# EAGLE design Mini Power Supply (EAGLE 6.4)
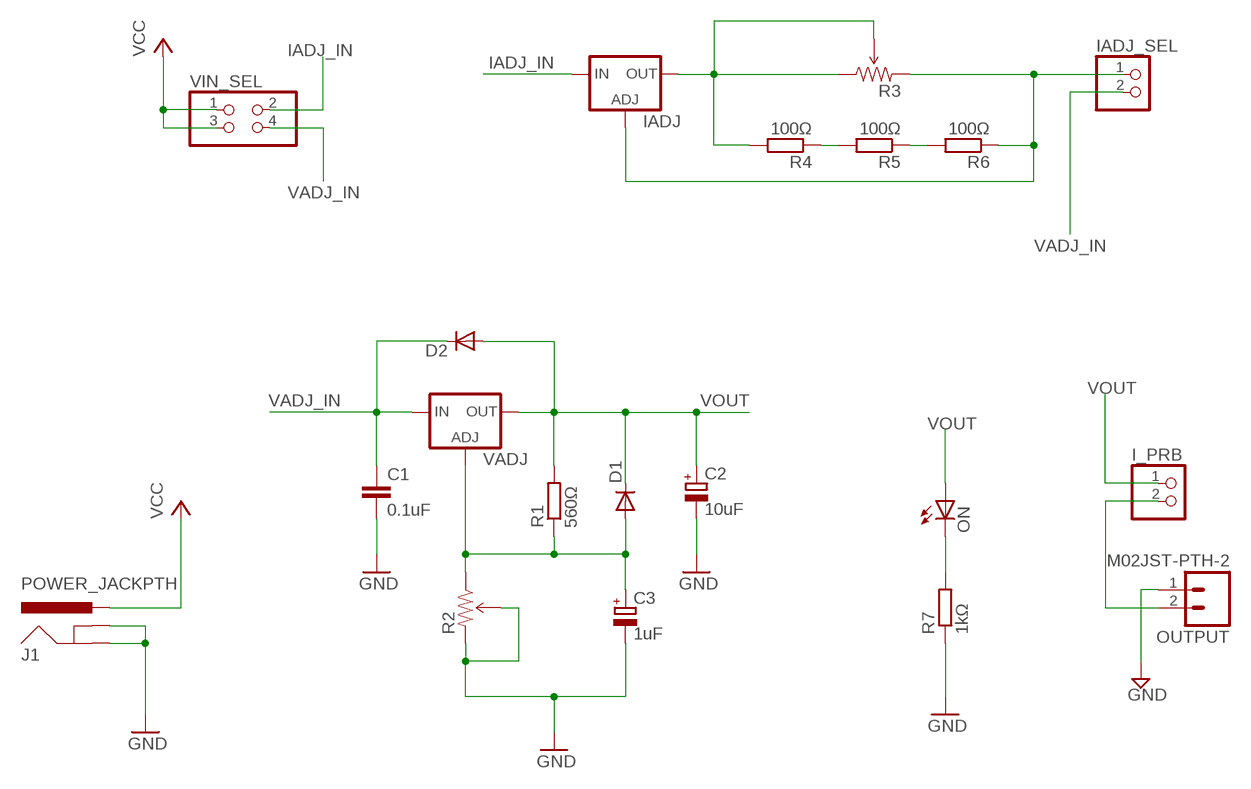
[diagram p0: schematic, sheet 1]

## Parts
C1  0.1uF  C-EUC0805  [C0805]
C2  10uF  CPOL-EUE2.5-6  [E2,5-6]
C3  1uF  CPOL-EUE2.5-6  [E2,5-6]
D1  DIODE-SOD323-W  [SOD323-W]
D2  DIODE-SOD323-W  [SOD323-W]
I_PRB  PINHD-1X2  [1X02]
IADJ  LM317TS  [317TS]
IADJ_SEL  PINHD-1X2  [1X02]
J1  POWER_JACKPTH  [POWER_JACK_PTH]
ON  LEDCHIPLED_1206  [CHIPLED_1206]
OUTPUT  M02JST-PTH-2  [JST-2-PTH]
R1  560Ω  R-EU_R0805  [R0805]
R2  TRIMPOT-PTH-KNOB  [3386U]
R3  TRIMPOT-PTH-KNOB  [3386U]
R4  100Ω  R-EU_R0805  [R0805]
R5  100Ω  R-EU_R0805  [R0805]
R6  100Ω  R-EU_R0805  [R0805]
R7  1kΩ  R-EU_R0805  [R0805]
VADJ  LM317TS  [317TS]
VIN_SEL  PINHD-2X2  [2X02]

## Nets
GND: C1.2 C2.- C3.- J1.GND J1.GNDBREAK OUTPUT.1 R2.2(WIPER) R2.3(CW) R7.1
IADJ_IN: IADJ.3(IN) VIN_SEL.2
N$1: IADJ.2(OUT) R3.1(CCW) R3.2(WIPER) R4.2
N$2: R4.1 R5.2
N$3: C3.+ D1.A R1.1 R2.1(CCW) VADJ.1(ADJ)
N$4: IADJ.1(ADJ) IADJ_SEL.1 R3.3(CW) R6.1
N$5: R5.1 R6.2
N$6: ON.C R7.2
N$7: I_PRB.2 OUTPUT.2
VADJ_IN: C1.1 D2.C IADJ_SEL.2 VADJ.3(IN) VIN_SEL.4
VCC: J1.PWR VIN_SEL.1 VIN_SEL.3
VOUT: C2.+ D1.C D2.A I_PRB.1 ON.A R1.2 VADJ.2(OUT)

## Library data of the parts
C1 = rcl:C-EU: CAPACITOR, European symbol
C2 C3 = rcl:CPOL-EU: POLARIZED CAPACITOR, European symbol
D1 D2 = diode:DIODE-: DIODE
I_PRB IADJ_SEL = pinhead:PINHD-1X2: PIN HEADER
IADJ VADJ = v-reg:LM317TS: VOLTAGE REGULATOR
J1 = SparkFun-Connectors:POWER_JACK: Power Jack This is the standard 5.5mm barrel jack for power. The PTH is the most common, proven, reliable, footprint. The Slot footprint only works if the mill layer is transmitted to the PCB fab house so be warned. Spark Fun Electronics SKU : PRT-00119 SMT: CONN-08106 Mating wall wart : TOL-00298 (and others)
ON = led:LED: LED OSRAM: - CHIPLED LG R971, LG N971, LY N971, LG Q971, LY Q971, LO R971, LY R971 LH N974, LH R974 LS Q976, LO Q976, LY Q976 LO Q996 - Hyper CHIPLED LW Q18S LB Q993, LB Q99A, LB R99A - SideLED LS A670, LO A670, LY A670, LG A670, LP A670 LB A673, LV A673, LT A673, LW A673 LH A674 LY A675 LS A676, LA A676, LO A676, LY A676, LW A676 LS A679, LY A679, LG A679 - Hyper Micro SIDELED® LS Y876, LA Y876, LO Y876, LY Y876 LT Y87S - SmartLED LW L88C, LW L88S LB L89C, LB L89S, LG L890 LS L89K, LO L89K, LY L89K LS L896, LA L896, LO L896, LY L896 - TOPLED LS T670, LO T670, LY T670, LG T670, LP T670 LSG T670, LSP T670, LSY T670, LOP T670, LYG T670 LG T671, LOG T671, LSG T671 LB T673, LV T673, LT T673, LW T673 LH T674 LS T676, LA T676, LO T676, LY T676, LB T676, LH T676, LSB T676, LW T676 LB T67C, LV T67C, LT T67C, LS T67K, LO T67K, LY T67K, LW E67C LS E67B, LA E67B, LO E67B, LY E67B, LB E67C, LV E67C, LT E67C LW T67C LS T679, LY T679, LG T679 LS T770, LO T770, LY T770, LG T770, LP T770 LB T773, LV T773, LT T773, LW T773 LH T774 LS E675, LA E675, LY E675, LS T675 LS T776, LA T776, LO T776, LY T776, LB T776 LHGB T686 LT T68C, LB T68C - Hyper Mini TOPLED® LB M676 - Mini TOPLED Santana® LG M470 LS M47K, LO M47K, LY M47K Source: http://www.osram.convergy.de LUXEON: - LUMILED® LXK2-PW12-R00, LXK2-PW12-S00, LXK2-PW14-U00, LXK2-PW14-V00 LXK2-PM12-R00, LXK2-PM12-S00, LXK2-PM14-U00 LXK2-PE12-Q00, LXK2-PE12-R00, LXK2-PE12-S00, LXK2-PE14-T00, LXK2-PE14-U00 LXK2-PB12-K00, LXK2-PB12-L00, LXK2-PB12-M00, LXK2-PB14-N00, LXK2-PB14-P00, LXK2-PB14-Q00 LXK2-PR12-L00, LXK2-PR12-M00, LXK2-PR14-Q00, LXK2-PR14-R00 LXK2-PD12-Q00, LXK2-PD12-R00, LXK2-PD12-S00 LXK2-PH12-R00, LXK2-PH12-S00 LXK2-PL12-P00, LXK2-PL12-Q00, LXK2-PL12-R00 Source: www.luxeon.com KINGBRIGHT: KA-3528ASYC Source: www.kingbright.com
OUTPUT = SparkFun-Connectors:M02: Standard 2-pin 0.1" header. Use with - straight break away headers ( PRT-00116) - right angle break away headers (PRT-00553) - swiss pins (PRT-00743) - machine pins (PRT-00117) - female headers (PRT-00115) Molex polarized connector foot print use with: PRT-08233 with associated crimp pins and housings. 2.54_SCREWTERM for use with PRT-10571. 3.5mm Screw Terminal footprints for PRT-08084 5mm Screw Terminal footprints for use with PRT-08433
R1 R4-R7 = rcl:R-EU_: RESISTOR, European symbol
R2 R3 = SparkFun-Electromechanical:TRIMPOT: Various small potentiometers for "set-and-forget" applications
VIN_SEL = pinhead:PINHD-2X2: PIN HEADER

## Board
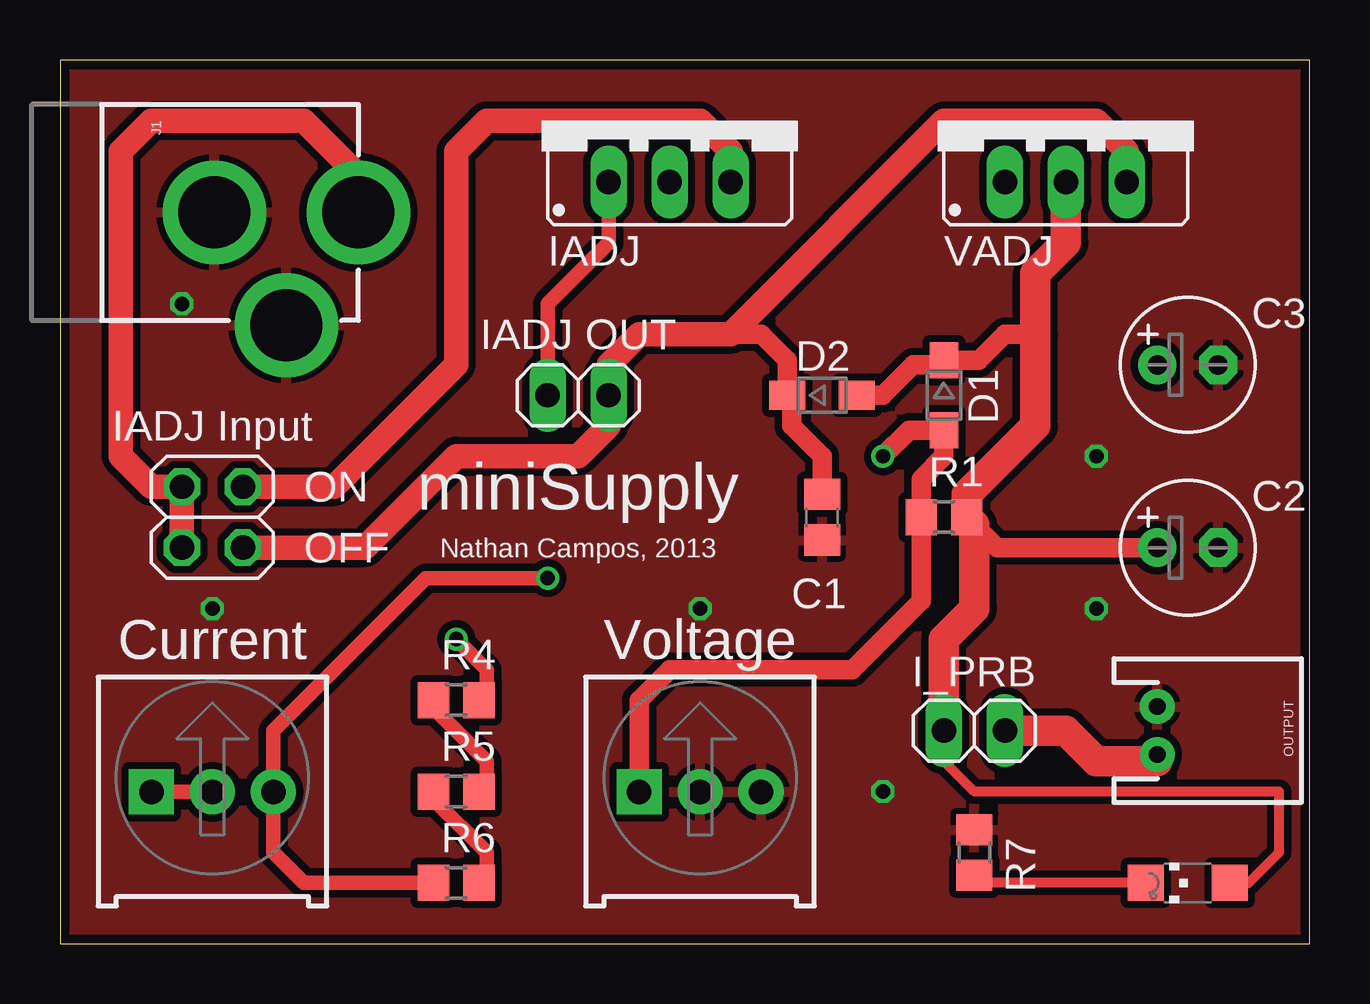
[diagram p1: board, top side]
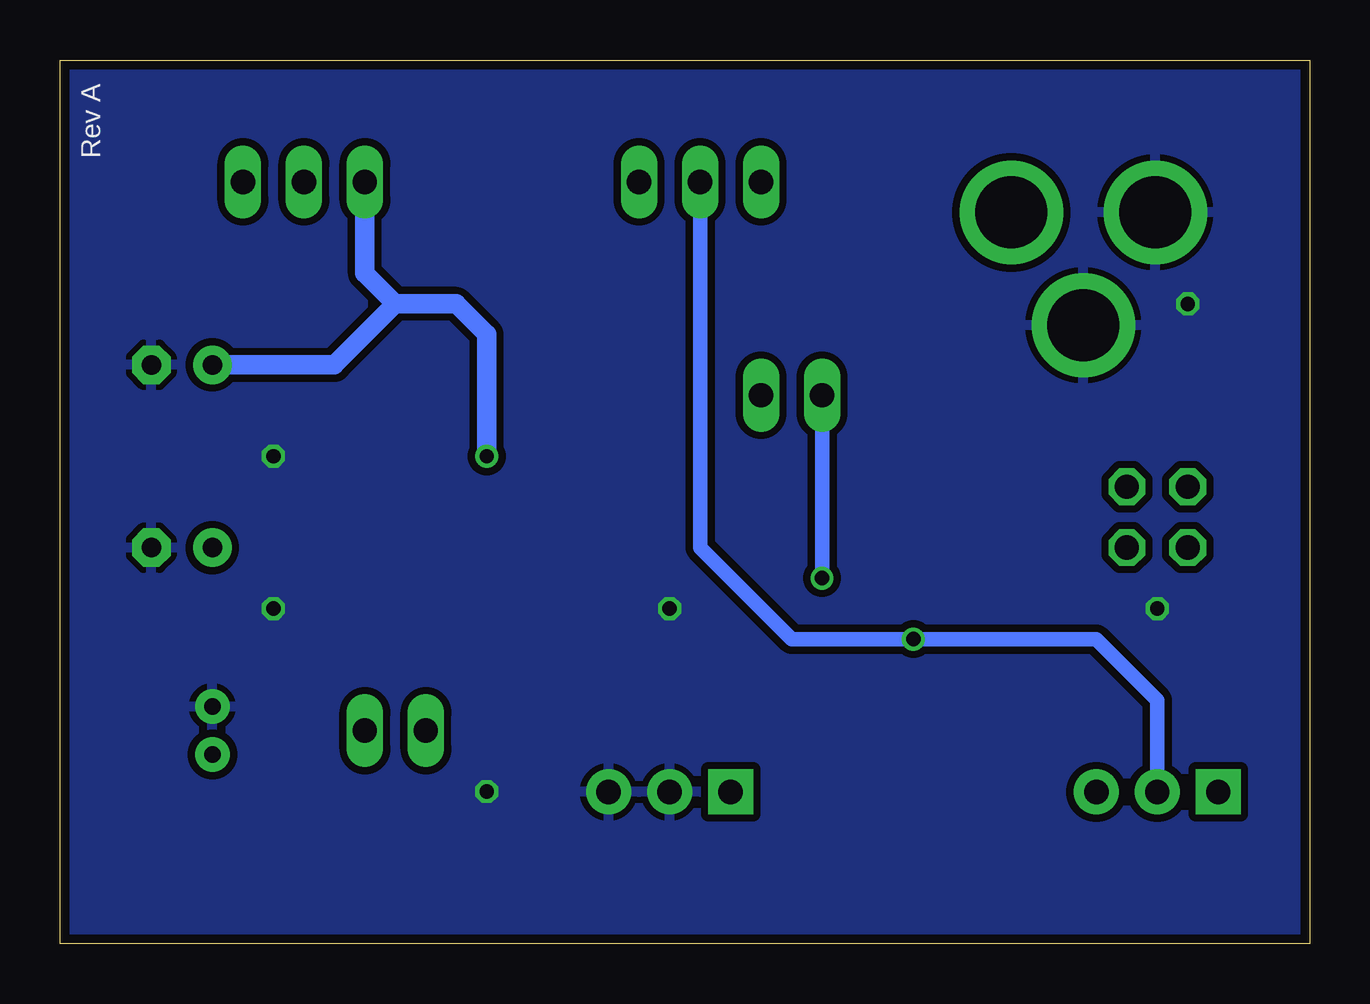
[diagram p2: board, bottom side, seen from below]

Size 52.07 x 36.83 mm. Coordinates in mm from the lower left corner, seen from the top.
Outline: 0,0 52.07,0 52.07,36.83 0,36.83 0,0
Copper layers (1*16): Top 0.0356mm / dielectric 1.5011mm / Bottom 0.0356mm
Design rules "LaenPCBOrder": minimum track width 6mil, minimum drill 13mil, track to track 6mil, track to pad 6mil, pad to pad 6mil, via to via 6mil, smd to smd 6mil, copper to edge 15mil, drill to drill 6mil, minimum pad ring 7mil, minimum via ring 7mil, stop-mask expansion 4mil, vias tented up to drill 0mil, thermal gap 10mil

### Footprints (pad centres in the part's own frame; a part is rotated, then mirrored left to right if it is on the bottom)
C0805 = smd 1.3 x 1.5: 1 -0.95,0; 2 0.95,0
E2,5-6 = drill 0.813 pad 1.6: + -1.27,0 | drill 0.813 pad 1.6 octagon: - 1.27,0
SOD323-W = smd 1.5 x 1.2: A 1.45,0; C -1.45,0
1X02 = drill 1.016 long: 1 -1.27,0; 2 1.27,0
317TS = drill 1.016 long: 1 -2.54,-2.54; 2 0,-2.54; 3 2.54,-2.54
POWER_JACK_PTH = drill 2.997 pad 4.318: GND 0,7.7; GNDBREAK 4.7,10.7; PWR 0,13.7
CHIPLED_1206 = smd 1.5 x 1.5: A 0,-1.75; C 0,1.75
JST-2-PTH = drill 0.7 pad 1.448: 1 -1,0; 2 1,0
R0805 = smd 1.3 x 1.5: 1 -0.95,0; 2 0.95,0
3386U = drill 1.016 pad 1.88 square: 1 -2.54,-0.015 | drill 1.016 pad 1.88: 2 0,-0.015; 3 2.54,-0.015
2X02 = drill 1.016 octagon: 1 -1.27,-1.27; 2 -1.27,1.27; 3 1.27,-1.27; 4 1.27,1.27

### Placement (x,y rotation side)
C1  31.75,17.78 270 top
C2  46.99,16.51 0 top
C3  46.99,24.13 0 top
D1  36.83,22.86 270 top
D2  31.75,22.86 0 top
I_PRB  38.1,8.89 0 top
IADJ  25.4,34.29 0 top
IADJ_SEL  21.59,22.86 0 top
J1  -1.27,30.48 270 top
ON  46.99,2.54 90 top
OUTPUT  45.72,8.89 270 top
R1  36.83,17.78 0 top
R2  26.67,6.35 0 top
R3  6.35,6.35 0 top
R4  16.51,10.16 0 top
R5  16.51,6.35 0 top
R6  16.51,2.54 0 top
R7  38.1,3.81 270 top
VADJ  41.91,34.29 0 top
VIN_SEL  6.35,17.78 270 top

### Tracks (layer width: path | path; a pad name or v marks a point on that pad's centre or on a via)
GND  (via drill 0.6)
  other vias: 5.08,26.67 6.35,13.97 26.67,13.97 34.29,6.35 43.18,13.97 43.18,20.32
  pour Bottom (isolate 0.305): 0,36.83 52.07,36.83 52.07,0 0,0
  pour Top (isolate 0.305): 0,36.83 52.07,36.83 52.07,0 0,0
IADJ_IN
  Top 1.016: VIN_SEL.2 11.43,19.05 16.51,24.13 16.51,33.02 17.78,34.29 26.67,34.29 27.94,33.02 IADJ.3
N$1  (via drill 0.6)
  Top 0.61: v16.51,12.7 17.78,11.43 17.78,10.16 R4.2 | R3.2 R3.1
  Bottom 0.61: R3.2 6.35,10.16 8.89,12.7 v16.51,12.7 21.59,12.7 25.4,16.51 IADJ.2
N$2
  Top 0.61: R4.1 15.56,9.84 17.78,7.62 17.78,6.67 R5.2
N$3  (via drill 0.6)
  Top 0.813: R2.1 24.13,10.16 25.4,11.43 33.02,11.43 35.88,14.29 R1.1 35.88,19.37 36.83,20.32 D1.A 35.38,21.41 v34.29,20.32
  Bottom 0.813: v34.29,20.32 34.29,25.4 35.56,26.67 38.1,26.67 | 38.1,26.67 39.37,27.94 VADJ.1 | C3.+ 40.64,24.13 38.1,26.67
N$4  (via drill 0.6)
  Top 0.61: R6.1 10.16,2.54 8.89,3.81 R3.3 8.89,8.89 15.24,15.24 v20.32,15.24 | IADJ.1 22.86,29.21 20.32,26.67 IADJ_SEL.1
  Bottom 0.61: v20.32,15.24 IADJ_SEL.1
N$5
  Top 0.61: R5.1 15.56,6.03 17.78,3.81 17.78,2.54 R6.2
N$6
  Top 0.406: ON.C 38.42,2.54 R7.2
N$7
  Top 1.27: I_PRB.2 41.91,8.89 43.18,7.62 45.72,7.62 OUTPUT.2
VADJ_IN
  Top 0.813: C1.1 31.75,20.32 30.48,21.59 30.48,22.68 D2.C 30.3,24.31 29.21,25.4 27.94,25.4
  Top 1.016: VIN_SEL.4 12.7,16.51 16.51,20.32 21.59,20.32 22.86,21.59 IADJ_SEL.2 22.86,24.13 24.13,25.4 27.94,25.4 36.83,34.29 43.18,34.29 44.45,33.02 VADJ.3
VCC
  Top 1.016: J1.PWR 12.43,32.02 10.16,34.29 3.81,34.29 2.54,33.02 2.54,20.32 3.81,19.05 VIN_SEL.1 VIN_SEL.3
VOUT
  Top 0.406: ON.A 49.53,2.54 50.8,3.81 50.8,6.35 38.1,6.35 36.83,7.62 I_PRB.1
  Top 0.813: D2.A 34.29,22.86 35.56,24.13 36.65,24.13 D1.C 38.28,24.31 39.37,25.4 40.64,25.4 | C2.+ 39.05,16.51 R1.2
  Top 1.27: I_PRB.1 36.83,12.7 38.1,13.97 38.1,17.46 R1.2 37.78,18.73 40.64,21.59 40.64,25.4 40.64,27.94 41.91,29.21 VADJ.2

### Text on the board
tPlace: IADJ OUT | IADJ Input | ON | miniSupply | OFF | Nathan Campos, 2013 | Current | Voltage
bPlace: Rev A